# EAGLE schematic big picture 2 (EAGLE 9.2.0)
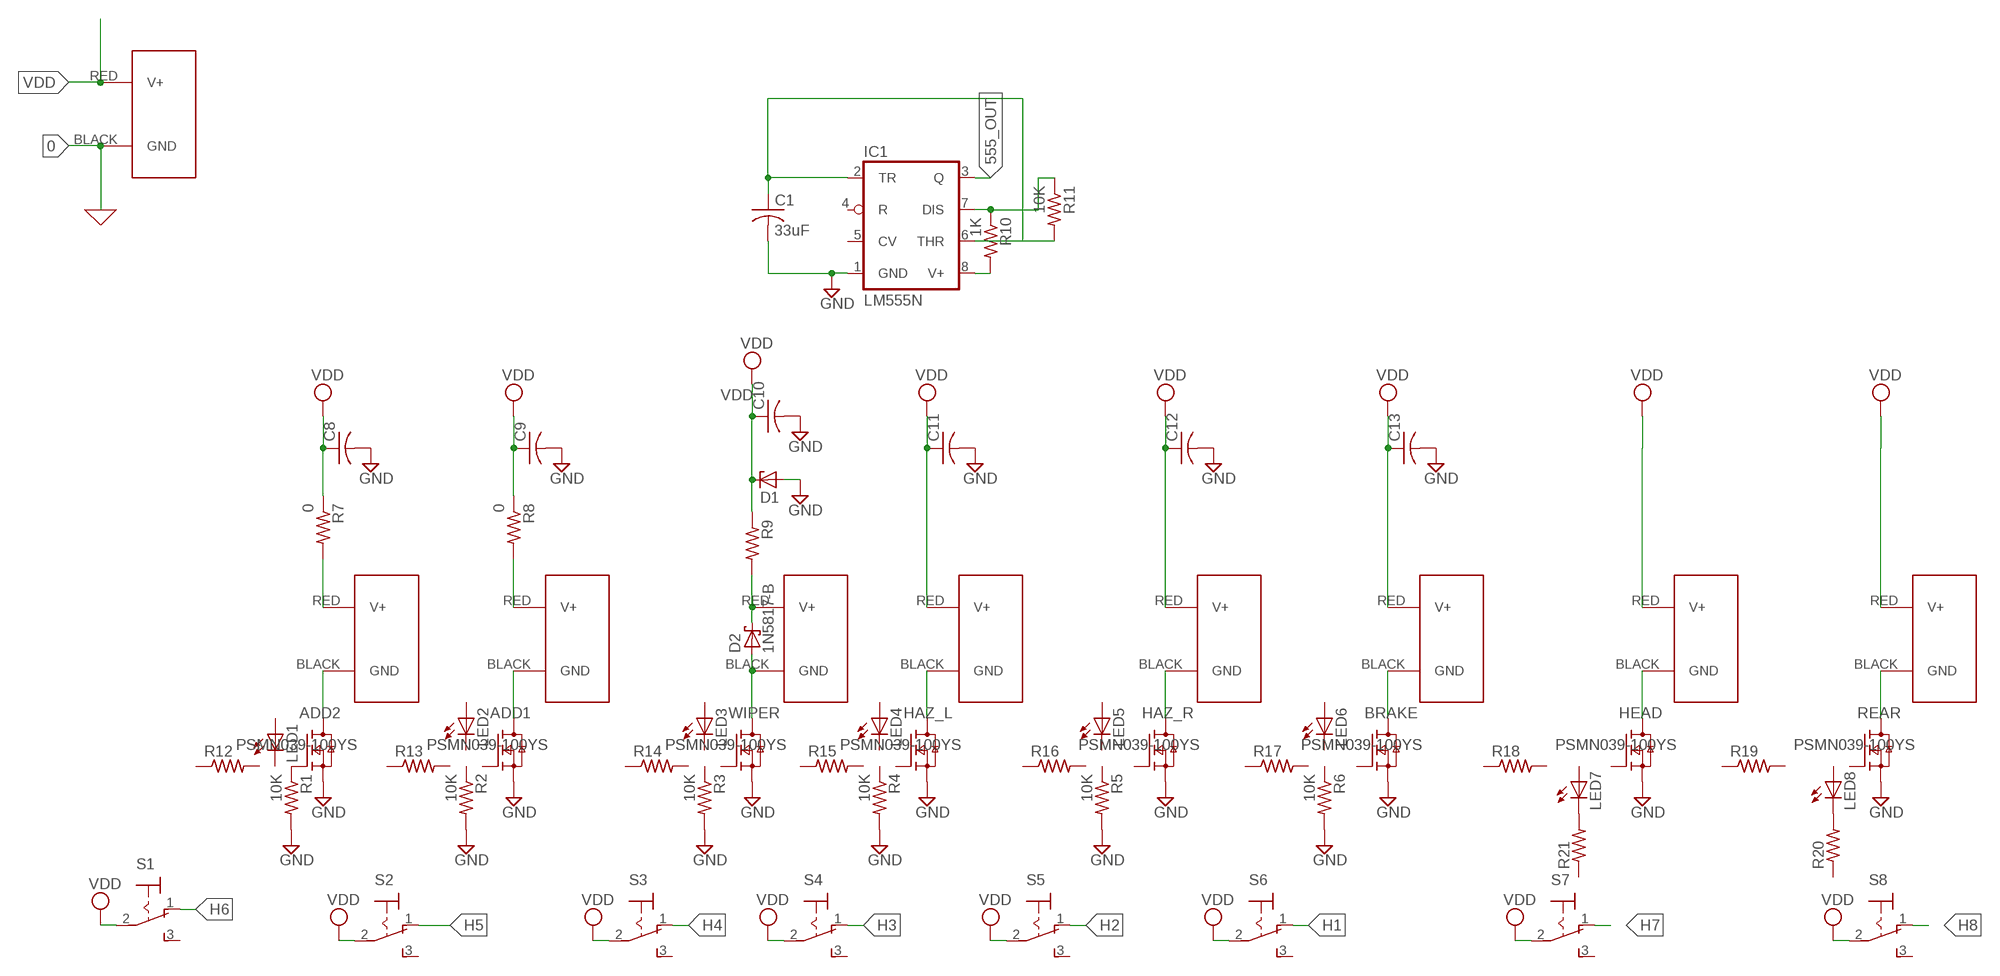
[diagram p0: schematic, sheet 1]

## Parts
ADD1  PSMN039-100YS  [SOT669]
ADD2  PSMN039-100YS  [SOT669]
ADD2_OUT  POWERPOLE_POWER25A  [POWERPOLE_PAIR_25A]
ADD2_OUT1  POWERPOLE_POWER25A  [POWERPOLE_PAIR_25A]
ADD2_OUT2  POWERPOLE_POWER25A  [POWERPOLE_PAIR_25A]
ADD2_OUT3  POWERPOLE_POWER25A  [POWERPOLE_PAIR_25A]
ADD2_OUT4  POWERPOLE_POWER25A  [POWERPOLE_PAIR_25A]
ADD2_OUT5  POWERPOLE_POWER25A  [POWERPOLE_PAIR_25A]
ADD2_OUT6  POWERPOLE_POWER25A  [POWERPOLE_PAIR_25A]
ADD2_OUT7  POWERPOLE_POWER25A  [POWERPOLE_PAIR_25A]
BRAKE  PSMN039-100YS  [SOT669]
C1  33uF  C-USC0805  [C0805]
C8  C-USC0805  [C0805]
C9  C-USC0805  [C0805]
C10  C-USC0805  [C0805]
C11  C-USC0805  [C0805]
C12  C-USC0805  [C0805]
C13  C-USC0805  [C0805]
D1  ZENER-DIODEDO34-7  [DO34Z7]
D2  1N5817-B  [DO41-7.6]
HAZ_L  PSMN039-100YS  [SOT669]
HAZ_R  PSMN039-100YS  [SOT669]
HEAD  PSMN039-100YS  [SOT669]
IC1  LM555N  [DIL08]
LED1  LEDCHIP-LED0805  [CHIP-LED0805]
LED2  LEDCHIP-LED0805  [CHIP-LED0805]
LED3  LEDCHIP-LED0805  [CHIP-LED0805]
LED4  LEDCHIP-LED0805  [CHIP-LED0805]
LED5  LEDCHIP-LED0805  [CHIP-LED0805]
LED6  LEDCHIP-LED0805  [CHIP-LED0805]
LED7  LEDCHIP-LED0805  [CHIP-LED0805]
LED8  LEDCHIP-LED0805  [CHIP-LED0805]
R1  10K  R-US_R0805  [R0805]
R2  10K  R-US_R0805  [R0805]
R3  10K  R-US_R0805  [R0805]
R4  10K  R-US_R0805  [R0805]
R5  10K  R-US_R0805  [R0805]
R6  10K  R-US_R0805  [R0805]
R7  0  R-US_R0805  [R0805]
R8  0  R-US_R0805  [R0805]
R9  R-US_R0805  [R0805]
R10  1K  R-US_R0805  [R0805]
R11  10K  R-US_R0805  [R0805]
R12  R-US_R0805  [R0805]
R13  R-US_R0805  [R0805]
R14  R-US_R0805  [R0805]
R15  R-US_R0805  [R0805]
R16  R-US_R0805  [R0805]
R17  R-US_R0805  [R0805]
R18  R-US_R0805  [R0805]
R19  R-US_R0805  [R0805]
R20  R-US_R0805  [R0805]
R21  R-US_R0805  [R0805]
REAR  PSMN039-100YS  [SOT669]
S1  M9040P  [M9040P]
S2  M9040P  [M9040P]
S3  M9040P  [M9040P]
S4  M9040P  [M9040P]
S5  M9040P  [M9040P]
S6  M9040P  [M9040P]
S7  M9040P  [M9040P]
S8  M9040P  [M9040P]
VDD_IN  POWERPOLE_POWER25A  [POWERPOLE_PAIR_25A]
WIPER  PSMN039-100YS  [SOT669]

## Nets
0: VDD_IN.BLACK(GND) ; supply symbol labelled GND
555_OUT: IC1.3(Q)
GND: ADD1.1(S) ADD1.2(S) ADD1.3(S) ADD2.1(S) ADD2.2(S) ADD2.3(S) BRAKE.1(S) BRAKE.2(S) BRAKE.3(S) C1.2 C8.2 C9.2 C10.2 C11.2 C12.2 C13.2 D1.A HAZ_L.1(S) HAZ_L.2(S) HAZ_L.3(S) HAZ_R.1(S) HAZ_R.2(S) HAZ_R.3(S) HEAD.1(S) HEAD.2(S) HEAD.3(S) IC1.1(GND) R1.2 R2.2 R3.2 R4.2 R5.2 R6.2 REAR.1(S) REAR.2(S) REAR.3(S) WIPER.1(S) WIPER.2(S) WIPER.3(S)
H1: S6.1(O)
H2: S5.1(O)
H3: S4.1(O)
H4: S3.1(O)
H5: S2.1(O)
H6: S1.1(O)
H7: S7.1(O)
H8: S8.1(O)
N$1: ADD2_OUT6.BLACK(GND) HEAD.MB(D)
N$2: R12.2
N$3: ADD2_OUT7.BLACK(GND) REAR.MB(D)
N$4: C1.1 IC1.2(TR) IC1.6(THR) R11.2
N$5: IC1.7(DIS) R10.1 R11.1
N$6: IC1.8(V+) R10.2
N$7: ADD2.4(G) R1.1
N$8: ADD2.MB(D) ADD2_OUT.BLACK(GND)
N$9: LED8.C R20.2
N$10: LED7.C R21.2
N$16: ADD2_OUT.RED(V+) R7.2
N$17: ADD1.MB(D) ADD2_OUT1.BLACK(GND)
N$18: ADD2_OUT1.RED(V+) R8.2
N$19: ADD2_OUT2.BLACK(GND) D2.A WIPER.MB(D)
N$20: ADD2_OUT2.RED(V+) D2.C R9.2
N$21: ADD2_OUT3.BLACK(GND) HAZ_L.MB(D)
N$23: ADD2_OUT4.BLACK(GND) HAZ_R.MB(D)
N$25: ADD2_OUT5.BLACK(GND) BRAKE.MB(D)
VDD: ADD2_OUT3.RED(V+) ADD2_OUT4.RED(V+) ADD2_OUT5.RED(V+) ADD2_OUT6.RED(V+) ADD2_OUT7.RED(V+) C8.1 C9.1 C10.1 C11.1 C12.1 C13.1 D1.C R7.1 R8.1 R9.1 S1.2(P) S2.2(P) S3.2(P) S4.2(P) S5.2(P) S6.2(P) S7.2(P) S8.2(P) VDD_IN.RED(V+)
Unconnected: ADD1.4(G) BRAKE.4(G) HAZ_L.4(G) HAZ_R.4(G) HEAD.4(G) IC1.4(R) IC1.5(CV) LED1.A LED1.C LED2.A LED2.C LED3.A LED3.C LED4.A LED4.C LED5.A LED5.C LED6.A LED6.C LED7.A LED8.A R2.1 R3.1 R4.1 R5.1 R6.1 R12.1 R13.1 R13.2 R14.1 R14.2 R15.1 R15.2 R16.1 R16.2 R17.1 R17.2 R18.1 R18.2 R19.1 R19.2 R20.1 R21.1 REAR.4(G) S1.3(S) S2.3(S) S3.3(S) S4.3(S) S5.3(S) S6.3(S) S7.3(S) S8.3(S) WIPER.4(G)

## Library data of the parts
ADD1 ADD2 BRAKE HAZ_L HAZ_R HEAD REAR WIPER = nxp_60:PSMN: N-channel logic level TrenchMOS(TM) transistor AAL Eindhoven MK
ADD2_OUT ADD2_OUT1-ADD2_OUT7 VDD_IN = powerpoles:POWERPOLE_POWER: Anderson Powerpole Power Connector using ameteur radio standard layout
C1 C8-C13 = rcl:C-US: CAPACITOR, American symbol; SPICEPREFIX: C
D1 = diode:ZENER-DIODE: Z-Diode
D2 = diode:1N581*: 1.0A SCHOTTKY BARRIER RECTIFIER Source: http://www.diodes.com/datasheets/ds23001.pdf
IC1 = linear:*555: TIMER; SPICEPREFIX: X
LED1-LED8 = led:LED: LED OSRAM: - CHIPLED LG R971, LG N971, LY N971, LG Q971, LY Q971, LO R971, LY R971 LH N974, LH R974 LS Q976, LO Q976, LY Q976 LO Q996 - Hyper CHIPLED LW Q18S LB Q993, LB Q99A, LB R99A - SideLED LS A670, LO A670, LY A670, LG A670, LP A670 LB A673, LV A673, LT A673, LW A673 LH A674 LY A675 LS A676, LA A676, LO A676, LY A676, LW A676 LS A679, LY A679, LG A679 - Hyper Micro SIDELED® LS Y876, LA Y876, LO Y876, LY Y876 LT Y87S - SmartLED LW L88C, LW L88S LB L89C, LB L89S, LG L890 LS L89K, LO L89K, LY L89K LS L896, LA L896, LO L896, LY L896 - TOPLED LS T670, LO T670, LY T670, LG T670, LP T670 LSG T670, LSP T670, LSY T670, LOP T670, LYG T670 LG T671, LOG T671, LSG T671 LB T673, LV T673, LT T673, LW T673 LH T674 LS T676, LA T676, LO T676, LY T676, LB T676, LH T676, LSB T676, LW T676 LB T67C, LV T67C, LT T67C, LS T67K, LO T67K, LY T67K, LW E67C LS E67B, LA E67B, LO E67B, LY E67B, LB E67C, LV E67C, LT E67C LW T67C LS T679, LY T679, LG T679 LS T770, LO T770, LY T770, LG T770, LP T770 LB T773, LV T773, LT T773, LW T773 LH T774 LS E675, LA E675, LY E675, LS T675 LS T776, LA T776, LO T776, LY T776, LB T776 LHGB T686 LT T68C, LB T68C - Hyper Mini TOPLED® LB M676 - Mini TOPLED Santana® LG M470 LS M47K, LO M47K, LY M47K Source: http://www.osram.convergy.de LUXEON: - LUMILED® LXK2-PW12-R00, LXK2-PW12-S00, LXK2-PW14-U00, LXK2-PW14-V00 LXK2-PM12-R00, LXK2-PM12-S00, LXK2-PM14-U00 LXK2-PE12-Q00, LXK2-PE12-R00, LXK2-PE12-S00, LXK2-PE14-T00, LXK2-PE14-U00 LXK2-PB12-K00, LXK2-PB12-L00, LXK2-PB12-M00, LXK2-PB14-N00, LXK2-PB14-P00, LXK2-PB14-Q00 LXK2-PR12-L00, LXK2-PR12-M00, LXK2-PR14-Q00, LXK2-PR14-R00 LXK2-PD12-Q00, LXK2-PD12-R00, LXK2-PD12-S00 LXK2-PH12-R00, LXK2-PH12-S00 LXK2-PL12-P00, LXK2-PL12-Q00, LXK2-PL12-R00 Source: www.luxeon.com KINGBRIGHT: KA-3528ASYC Source: www.kingbright.com
R1-R21 = rcl:R-US_: RESISTOR, American symbol; SPICEPREFIX: R
S1-S8 = switch:M9040P: TOGGLE SWITCH Marquardt